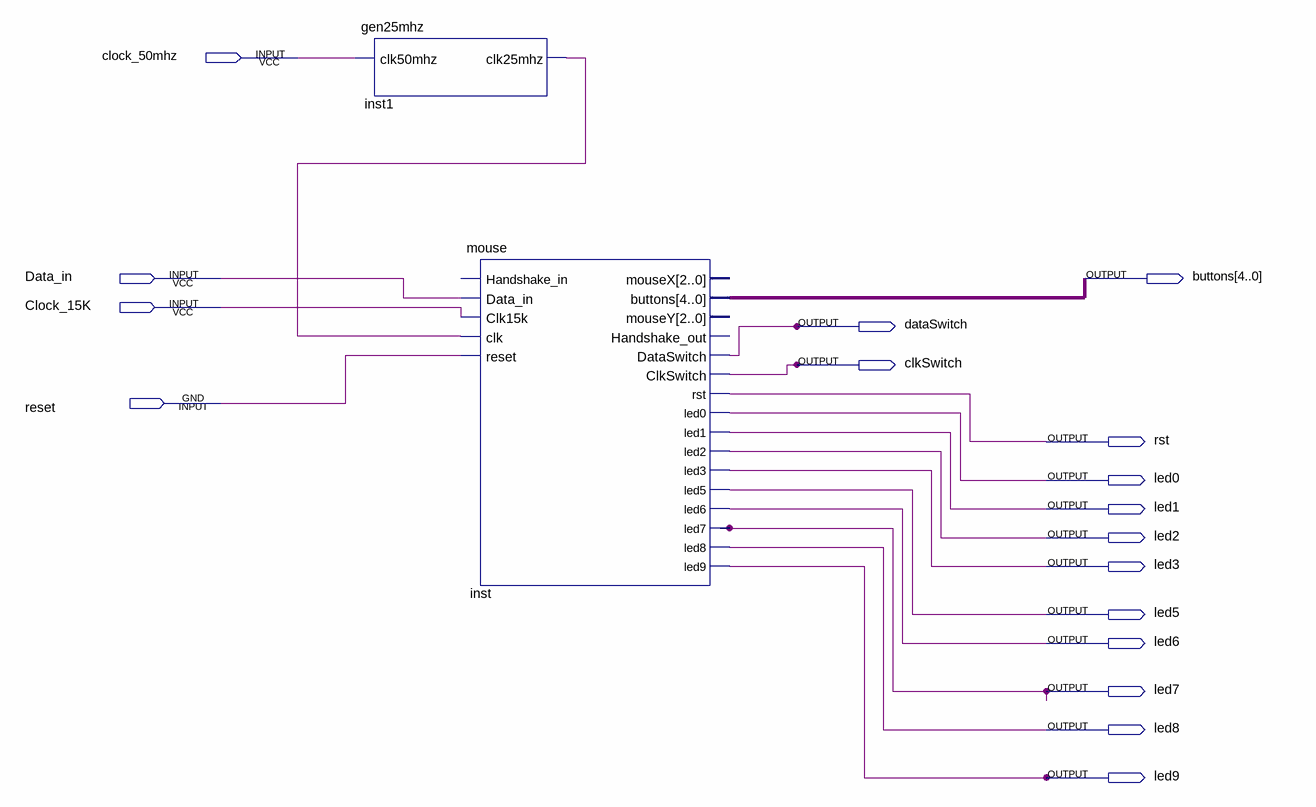
[diagram p0: schematic sheet]
// Quartus schematic top_de1.bdf as structural Verilog: 2 symbols, 17 pins
module top_de1 (
  input  clock_50mhz,
  input  Data_in,
  input  Clock_15K,
  input  reset,
  output [4:0] buttons,
  output dataSwitch,
  output clkSwitch,
  output rst,
  output led0,
  output led1,
  output led2,
  output led3,
  output led5,
  output led6,
  output led7,
  output led8,
  output led9
);

  wire inst1_clk25mhz;

  gen25mhz inst1 (.clk50mhz(clock_50mhz), .clk25mhz(inst1_clk25mhz));
  mouse inst (
    .Data_in(Data_in), .Clk15k(Clock_15K), .clk(inst1_clk25mhz), .reset(reset), .buttons(buttons),
    .DataSwitch(dataSwitch), .ClkSwitch(clkSwitch), .rst(rst), .led0(led0), .led1(led1), .led2(led2),
    .led3(led3), .led5(led5), .led6(led6), .led7(led7), .led8(led8), .led9(led9));  // open: Handshake_in, mouseX, mouseY, Handshake_out
endmodule
